# Altium schematic sheet POwer.SchDoc
size A3; SheetNumber: 1; SheetTotal: 6
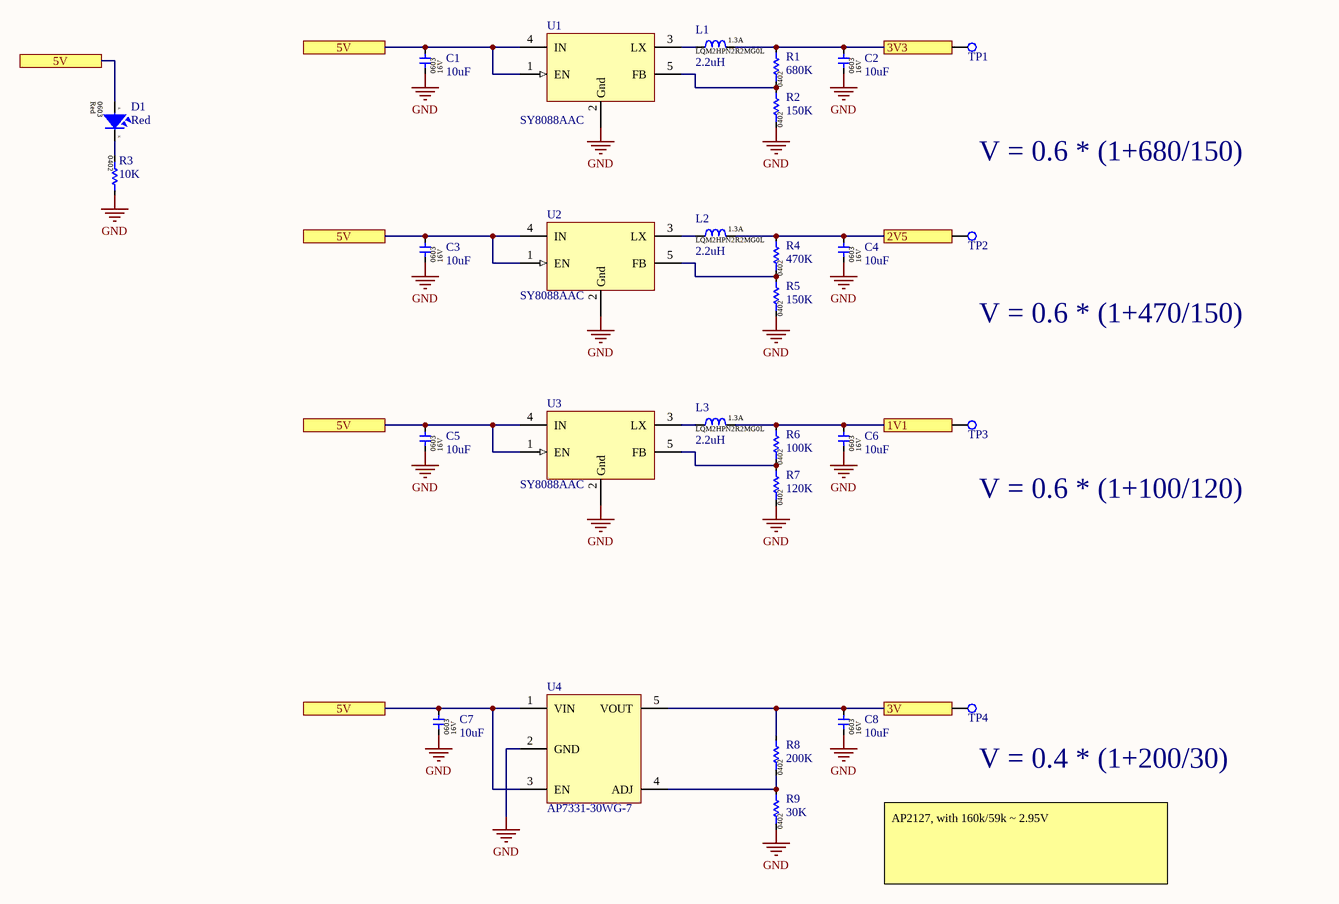
[diagram p0: POwer.SchDoc]

## Parts
C1  10uF  [CAP-0603]
C2  10uF  [CAP-0603]
C3  10uF  [CAP-0603]
C4  10uF  [CAP-0603]
C5  10uF  [CAP-0603]
C6  10uF  [CAP-0603]
C7  10uF  [CAP-0603]
C8  10uF  [CAP-0603]
D1  Red  [LED-0603 RED]
L1  2.2uH  [IND-1008]
L2  2.2uH  [IND-1008]
L3  2.2uH  [IND-1008]
R1  680K  [RES-0402]
R2  150K  [RES-0402]
R3  10K  [RES-0402]
R4  470K  [RES-0402]
R5  150K  [RES-0402]
R6  100K  [RES-0402]
R7  120K  [RES-0402]
R8  200K  [RES-0402]
R9  30K  [RES-0402]
TP1  N/A  [Test point]  (value not drawn)  (no BOM)
TP2  N/A  [Test point]  (value not drawn)  (no BOM)
TP3  N/A  [Test point]  (value not drawn)  (no BOM)
TP4  N/A  [Test point]  (value not drawn)  (no BOM)
U1  SY8088AAC  [SOT23-5]
U2  SY8088AAC  [SOT23-5]
U3  SY8088AAC  [SOT23-5]
U4  AP7331-30WG-7  [SOT23-5]

## Ports
1V1, 2V5, 3V, 3V3, 5V

## Nets
GND: C1.1 C2.1 C3.1 C4.1 C5.1 C6.1 C7.1 C8.1 R2.1 R3.2 R5.1 R7.1 R9.1 U1.2(Gnd) U2.2(Gnd) U3.2(Gnd) U4.2(GND)
1V1: C6.2 L3.2 R6.2 TP3.1 ; port 1V1
2V5: C4.2 L2.2 R4.2 TP2.1 ; port 2V5
3V: C8.2 R8.2 TP4.1 U4.5(VOUT) ; port 3V
3V3: C2.2 L1.2 R1.2 TP1.1 ; port 3V3
5V: C1.2 C3.2 C5.2 C7.2 D1.2(Anode) U1.1(EN) U1.4(IN) U2.1(EN) U2.4(IN) U3.1(EN) U3.4(IN) U4.1(VIN) U4.3(EN) ; port 5V
NetD1_1: D1.1(Cathode) R3.1
NetL1_1: L1.1 U1.3(LX)
NetL2_1: L2.1 U2.3(LX)
NetL3_1: L3.1 U3.3(LX)
NetR1_1: R1.1 R2.2 U1.5(FB)
NetR4_1: R4.1 R5.2 U2.5(FB)
NetR6_1: R6.1 R7.2 U3.5(FB)
NetR8_1: R8.1 R9.2 U4.4(ADJ)

## Notes on the sheet
- V = 0.6 * (1+680/150)
- V = 0.6 * (1+470/150)
- (near TP3) V = 0.6 * (1+100/120)
- (near TP4) V = 0.4 * (1+200/30)
- AP2127, with 160k/59k ~ 2.95V
- (in symbol 19-217/R6C-AL1M2VY/3T) A; K

## Library data of the parts
C1-C8 = 0603X106M160CT: 16V 10uF X5R ±20% 0603 Multilayer Ceramic Capacitors MLCC - SMD/SMT ROHS; Manufacture: WALSIN; Package / Case: 0402; Component type: Capacitor; Manufacture part: 0603X106M160CT; Capacitor value: 10uF; Voltage: 16V; Package: 0603
D1 = 19-217/R6C-AL1M2VY/3T: Red 617.5~633.5nm 0603 Light Emitting Diodes (LED) RoHS; Manufacture: Everlight Elec; Package / Case: 0402; Component type: Led; Part reference: *; Manufacture part: 19-217/R6C-AL1M2VY/3T; Color: Red; Package: 0603
L1-L3 = LQM2HPN2R2MG0L: Inductor 1008, 2.2±20%, 1.3A; Manufacture: Murata Electronics; DCR: 0.1 Ω; Manufacture part: LQM2HPN2R2MG0L; Inductance value: 2.2uH; Irms max: 1.3A; Package: 1008
R1 = WR04X6803FTL: ±1% 1/16W 50V ±100ppm/℃ -55℃~+155℃ 680kΩ 0402 Chip Resistor - Surface Mount ROHS; Manufacture: WALSIN; Package / Case: 0201; Component type: Resistor; Manufacture part: WR04X6803FTL; Resistor value: 680K; Package: 0402
R2 R5 = WR04X1503FTL: 150kΩ ±1% 1/16W ±100ppm/℃ 0402 Chip Resistor - Surface Mount RoHS; Manufacture: WALSIN; Package / Case: 0201; Component type: Resistor; Manufacture part: WR04X1503FTL; Resistor value: 150K; Package: 0402
R3 = WR04X1002FTL: 10kΩ ±1% 1/16W ±100ppm/℃ 0402 Chip Resistor - Surface Mount RoHS; Manufacture: WALSIN; Package / Case: 0201; Component type: Resistor; Manufacture part: WR04X1002FTL; Resistor value: 10K; Package: 0402
R4 = WR04X4703FTL: ±1% 1/16W 50V ±100ppm/℃ -55℃~+155℃ 470kΩ 0402 Chip Resistor - Surface Mount ROHS; Manufacture: WALSIN; Package / Case: 0201; Component type: Resistor; Manufacture part: WR04X4703FTL; Resistor value: 470K; Package: 0402
R6 = WR04X1003FTL: 100kΩ ±1% 1/16W ±100ppm/℃ 0402 Chip Resistor - Surface Mount RoHS; Manufacture: WALSIN; Package / Case: 0201; Component type: Resistor; Manufacture part: WR04X1003FTL; Resistor value: 100K; Package: 0402
R7 = WR04X1203FTL: 120kΩ ±1% 1/16W ±100ppm/℃ 0402 Chip Resistor - Surface Mount RoHS; Manufacture: WALSIN; Package / Case: 0201; Component type: Resistor; Manufacture part: WR04X1203FTL; Resistor value: 120K; Package: 0402
R8 = WR04X2003FTL: 200kΩ ±1% 1/16W ±100ppm/℃ 0402 Chip Resistor - Surface Mount RoHS; Manufacture: WALSIN; Package / Case: 0201; Component type: Resistor; Manufacture part: WR04X2003FTL; Resistor value: 200K; Package: 0402
R9 = WR04X3002FTL: ±1% 1/16W ±100ppm/℃ 30kΩ 0402 Chip Resistor - Surface Mount ROHS; Manufacture: WALSIN; Package / Case: 0201; Component type: Resistor; Manufacture part: WR04X3002FTL; Resistor value: 30K; Package: 0402
TP1-TP4 = N/A: A point used for measure.; Manufacture part: N/A; Manufacture: N/A; Type: Test point
U1-U3 = SY8088AAC: 5.5V 1A SOT-23-5 DC-DC Converters RoHS; Manufacture: Richtek Tech; Manufacture part: SY8088AAC; Type: Buck; Package: SOT23-5; Datasheet: https://datasheet.lcsc.com/lcsc/Silergy-Corp-SY8088AAC_C79313.pdf
U4 = AP7331-30WG-7: Fixed 6V 3V 550mV @ 300mA SOT-25 Dropout Regulators(LDO) RoHS; Manufacture: Diodes Incorporated; Part number: AP7331-WG-7; Manufacture part: AP7331-30WG-7; Type: LDO; Package: SOT23-5; Datasheet: https://datasheet.lcsc.com/lcsc/Diodes-Incorporated-AP7331-WG-7_C212322.pdf